# Altium project PHANTOM_VCU.PrjPcb (part 2 of 3)

## Sheet Power_MCU.SchDoc
size A4; DocumentNumber: 3; SheetNumber: 3; SheetTotal: 8
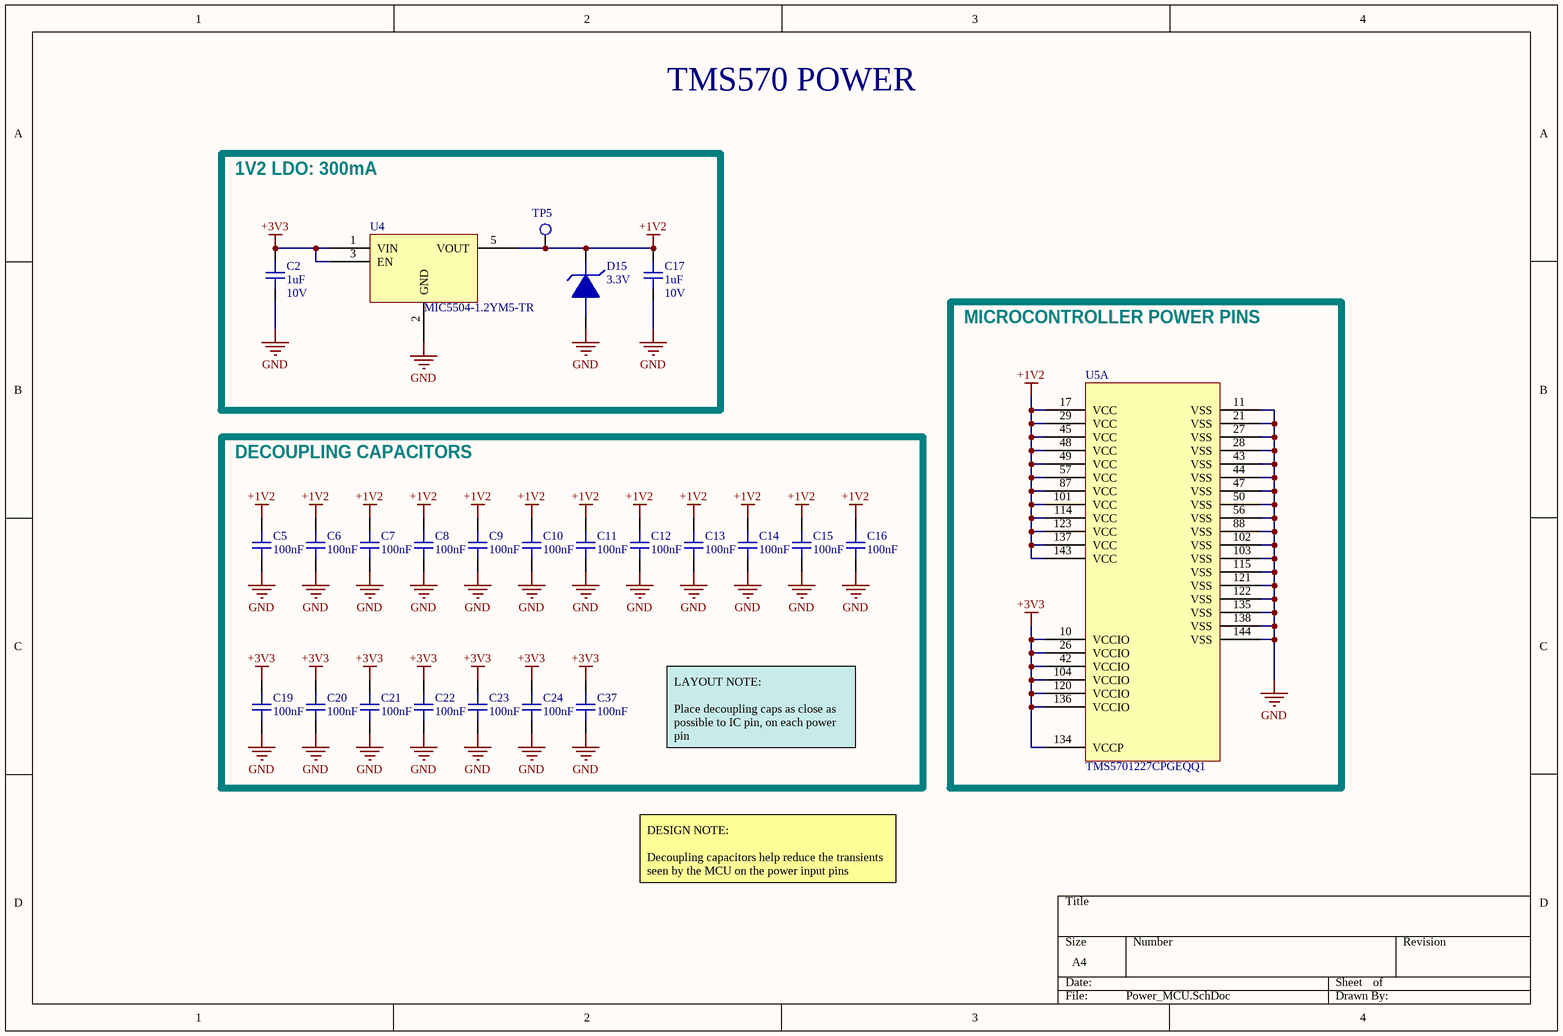
[diagram p3: Power_MCU.SchDoc]

### Parts
C2  1uF  Voltage Rating: 10V  [C0402]
C5  100nF  [C0402]
C6  100nF  [C0402]
C7  100nF  [C0402]
C8  100nF  [C0402]
C9  100nF  [C0402]
C10  100nF  [C0402]
C11  100nF  [C0402]
C12  100nF  [C0402]
C13  100nF  [C0402]
C14  100nF  [C0402]
C15  100nF  [C0402]
C16  100nF  [C0402]
C17  1uF  Voltage Rating: 10V  [C0402]
C19  100nF  [C0402]
C20  100nF  [C0402]
C21  100nF  [C0402]
C22  100nF  [C0402]
C23  100nF  [C0402]
C24  100nF  [C0402]
C37  100nF  [C0402]
D15  3.3V  [DIODE_TVS]
TP5  5015  [TP_HOOK]  (value not drawn)
U4  MIC5504-1.2YM5-TR  [SOT23-5-MIC5504]
U5  TMS5701227CPGEQQ1  [LQFP-144]  (part A of 3)

### Blocks framed on the sheet
1V2 LDO: 300mA: C2 C17 D15 TP5 U4
MICROCONTROLLER POWER PINS: U5
DECOUPLING CAPACITORS: C5-C16 C19-C24 C37

### Nets
+1V2: C5.2 C6.2 C7.2 C8.2 C9.2 C10.2 C11.2 C12.2 C13.2 C14.2 C15.2 C16.2 C17.2 D15.1 TP5.1 U4.5(VOUT) U5.17(VCC) U5.29(VCC) U5.45(VCC) U5.48(VCC) U5.49(VCC) U5.57(VCC) U5.87(VCC) U5.101(VCC) U5.114(VCC) U5.123(VCC) U5.137(VCC) U5.143(VCC)
+3V3: C2.2 C19.2 C20.2 C21.2 C22.2 C23.2 C24.2 C37.2 U4.1(VIN) U4.3(EN) U5.10(VCCIO) U5.26(VCCIO) U5.42(VCCIO) U5.104(VCCIO) U5.120(VCCIO) U5.134(VCCP) U5.136(VCCIO)
GND: C2.1 C5.1 C6.1 C7.1 C8.1 C9.1 C10.1 C11.1 C12.1 C13.1 C14.1 C15.1 C16.1 C17.1 C19.1 C20.1 C21.1 C22.1 C23.1 C24.1 C37.1 D15.2 U4.2(GND) U5.11(VSS) U5.21(VSS) U5.27(VSS) U5.28(VSS) U5.43(VSS) U5.44(VSS) U5.47(VSS) U5.50(VSS) U5.56(VSS) U5.88(VSS) U5.102(VSS) U5.103(VSS) U5.115(VSS) U5.121(VSS) U5.122(VSS) U5.135(VSS) U5.138(VSS) U5.144(VSS)

### Notes on the sheet
- TMS570 POWER
- LAYOUT NOTE:
  Place decoupling caps as close as possible to IC pin, on each power pin
- DESIGN NOTE:
  Decoupling capacitors help reduce the transients seen by the MCU on the power input pins

### Library data of the parts
C2 C17 = CL05A105MP5NNNC: CAP MLCC 1uF 10V 0402 X5R 20% SMD 0402 85C Paper T/R; Manufacturer: Samsung; Supplier 1: Digi-Key; Manufacturer Part Number: CL05A105MP5NNNC; Stock 1: 100000; Pricing 1: 1=0.1, 10=0.031, 100=0.014, 500=0.01, 1000=0.0079, 2500=0.0072, 5000=0.0066 (USD); Mount: Surface Mount; Case/Package: 0402; Case Code (Metric): 1005; Case Code (Imperial): 0402; Min Operating Temperature: -55°C; Max Operating Temperature: 85°C; Package Quantity: 1; Packaging: Tape and Reel; Capacitance: 1uF; Tolerance: 20%; Dielectric: X5R; Voltage Rating (DC): 10V; Length: 1mm; Height: 0.5mm; Width: 0.02inch; Thickness: 0.022inch; Depth: 0.5mm; Radiation Hardening: No; Lead Free: Lead Free; ComponentLink1URL: https://media.digikey.com/pdf/Data%20Sheets/Samsung%20PDFs/CL_Series_MLCC_ds.pdf; ComponentLink1Description: https://media.digikey.com/pdf/Data%20Sheets/Samsung%20PDFs/CL_Series_MLCC_ds.pdf; Supplier Part Number 1: 1276-1448-1-ND
C5-C16 C19-C24 C37 = CL05A104MP5NNNC: CAP MLCC 0.1uF 10V X5R 0402 20% SMD 0402 85C Paper T/R; Manufacturer: Samsung; Supplier 1: Digi-Key; Manufacturer Part Number: CL05A104MP5NNNC; Stock 1: 100000; Pricing 1: 1=0.1, 10=0.024, 100=0.0106, 500=0.0076, 1000=0.006, 2500=0.0054, 5000=0.005 (USD); Mount: Surface Mount; Case/Package: 0402; Case Code (Metric): 1005; Case Code (Imperial): 0402; Min Operating Temperature: -55°C; Max Operating Temperature: 85°C; Packaging: Tape and Reel; Capacitance: 100nF; Tolerance: 20%; Voltage Rating: 10V; Dielectric: X5R; Voltage Rating (DC): 10V; Length: 1mm; Height: 0.5mm; Width: 0.02inch; Thickness: 0.022inch; Depth: 0.5mm; Radiation Hardening: No; Lead Free: Lead Free; ComponentLink1URL: https://media.digikey.com/pdf/Data%20Sheets/Samsung%20PDFs/CL_Series_MLCC_ds.pdf; ComponentLink1Description: https://media.digikey.com/pdf/Data%20Sheets/Samsung%20PDFs/CL_Series_MLCC_ds.pdf; Supplier Part Number 1: 1276-1443-1-ND
D15 = 1SMA5913BT3G: DIODE ZENER 3.3V 1.5W SMA; Manufacturer: ON Semiconductor; Material: Plastic; Forward Voltage: 1.5V; Tolerance: 5%; Impedance: 10R; Max Reverse Leakage Current: 50uA; Power Dissipation: 500mW; Zener Current: 455mA; Test Current: 113.6mA; Element Configuration: Single; Breakdown Voltage: 3.47V; Supplier 1: Digi-Key; Manufacturer Part Number: 1SMA5913BT3G; Stock 1: 12228; Pricing 1: 1=0.38, 10=0.305, 100=0.2076, 500=0.1557, 1000=0.1168 (USD); Case/Package: SMA; Number of Pins: 2; Min Operating Temperature: -65°C; Max Operating Temperature: 150°C; Max Power Dissipation: 1.5W; Package Quantity: 1; Packaging: Tape and Reel; Zener Voltage: 3.3V; Voltage Tolerance: 5%; Working Voltage: 3.3V; Peak Reverse Current: 50uA; Voltage Rating (DC): 3.3V; Power Rating: 1.5W; Length: 4.57mm; Height: 2.05mm; Width: 2.92mm; Radiation Hardening: No; REACH SVHC: No SVHC; Lead Free: Lead Free; Halogen Free: Halogen Free; ComponentLink1URL: https://datasheet.ciiva.com/8026/1sma5913bt3-d-8026917.pdf; ComponentLink1Description: https://datasheet.ciiva.com/8026/1sma5913bt3-d-8026917.pdf; ComponentLink2URL: https://datasheet.ciiva.com/8345/1sma5913bt3-d-8345864.pdf; ComponentLink2Description: https://datasheet.ciiva.com/8345/1sma5913bt3-d-8345864.pdf; ComponentLink3URL: https://datasheet.ciiva.com/8346/1sma5913bt3-d-8346488.pdf; ComponentLink3Description: https://datasheet.ciiva.com/8346/1sma5913bt3-d-8346488.pdf; ComponentLink4URL: https://datasheet.ciiva.com/895/1sma5913bt3-d-895306.pdf; ComponentLink4Description: https://datasheet.ciiva.com/895/1sma5913bt3-d-895306.pdf; ComponentLink5URL: https://datasheet.ciiva.com/15142/getdatasheetpartid-90498-15142554.pdf; ComponentLink5Description: https://datasheet.ciiva.com/15142/getdatasheetpartid-90498-15142554.pdf; ComponentLink6URL: https://datasheet.ciiva.com/895/1sma5913bt3-d-895307.pdf; ComponentLink6Description: https://datasheet.ciiva.com/895/1sma5913bt3-d-895307.pdf; ComponentLink7URL: https://datasheet.ciiva.com/4733/1sma5913bt3-d-4733195.pdf; ComponentLink7Description: https://datasheet.ciiva.com/4733/1sma5913bt3-d-4733195.pdf; ComponentLink8URL: https://datasheet.ciiva.com/895/1sma5913bt3-d-895308.pdf; ComponentLink8Description: https://datasheet.ciiva.com/895/1sma5913bt3-d-895308.pdf; ComponentLink9URL: https://datasheet.ciiva.com/16472/1sma5913bt3-d-16472764.pdf; ComponentLink9Description: https://datasheet.ciiva.com/16472/1sma5913bt3-d-16472764.pdf; ComponentLink10URL: https://datasheet.ciiva.com/49027/70339279-49027772.pdf; ComponentLink10Description: https://datasheet.ciiva.com/49027/70339279-49027772.pdf; ComponentLink11URL: https://datasheet.ciiva.com/8026/1sma5913bt3-d-8026989.pdf; ComponentLink11Description: https://datasheet.ciiva.com/8026/1sma5913bt3-d-8026989.pdf; ComponentLink12URL: https://datasheet.ciiva.com/8026/1sma5913bt3-d-8026990.pdf; ComponentLink12Description: https://datasheet.ciiva.com/8026/1sma5913bt3-d-8026990.pdf; ComponentLink13URL: https://datasheet.ciiva.com/26092/1sma5913bt3-d-26092398.pdf; ComponentLink13Description: https://datasheet.ciiva.com/26092/1sma5913bt3-d-26092398.pdf; Supplier Part Number 1: 1SMA5913BT3GOSCT-ND
TP5 = 5015: TEST POINT, PCB, SMT; Manufacturer: Keystone Electronics; Number of Ports: 1; Supplier 1: Digi-Key; Manufacturer Part Number: 5015; Stock 1: 1937775; Pricing 1: 1=0.44, 10=0.421, 25=0.3604, 50=0.3064, 100=0.2944, 250=0.2644, 500=0.2524 (USD); Mount: Surface Mount; Colour: White; Contact Material: Bronze; Contact Plating: Tin,Silver,Lead; Material: Bronze,Silver; Package Quantity: 1; Packaging: Tape and Reel; Termination: Solder; Orientation: Straight; Length: 2.66mm; Height: 0.06inch; Thickness: 0.01inch; Depth: 1.01mm; REACH SVHC: No SVHC; Lead Free: Lead Free; ComponentLink1URL: https://datasheet.ciiva.com/2917/5015-2917616.pdf; ComponentLink1Description: https://datasheet.ciiva.com/2917/5015-2917616.pdf; ComponentLink2URL: https://datasheet.ciiva.com/2917/5015-2917617.pdf; ComponentLink2Description: https://datasheet.ciiva.com/2917/5015-2917617.pdf; ComponentLink3URL: https://datasheet.ciiva.com/1123/5015-1123862.pdf; ComponentLink3Description: https://datasheet.ciiva.com/1123/5015-1123862.pdf; ComponentLink4URL: https://datasheet.ciiva.com/16883/70182998-16883734.pdf; ComponentLink4Description: https://datasheet.ciiva.com/16883/70182998-16883734.pdf; Supplier Part Number 1: 36-5015CT-ND
U4 = MIC5504-1.2YM5-TR: IC LDO 1.2V 300mA Enable Pull-Down & Auto Discharge, 5 SOT-23 T/R; Manufacturer: Microchip; Dropout Voltage: 160mV; Number of Regulators: 1; Min Current Limit: 400mA; Supplier 1: Digi-Key; Manufacturer Part Number: MIC5504-1.2YM5-TR; Stock 1: 479; Pricing 1: 1=0.11, 25=0.0928, 100=0.0824 (USD); Mount: Surface Mount; Case/Package: SOT-23-5; Min Operating Temperature: -40°C; Max Operating Temperature: 125°C; Packaging: Cut Tape; Output Voltage: 1.2V; Output Current: 300mA; Supplier Part Number 1: 576-4878-1-ND
U5 = TMS5701227CPGEQQ1: IC MCU 16-Bit/32-Bit Hercules TMS570 ARM Cortex R4F RISC 1280KB Flash 1.2V/3.3V 144-Pin LQFP; Manufacturer: Texas Instruments; Frequency: 160MHz; Interface: CAN,EBI/EMI,Ethernet,I2C,LIN,SCI,SPI,UART,USART; Number of I/Os: 58; Oscillator Type: External; RAM Size: 192KB; Number of Timers/Counters: 2; Watchdog Timer: Yes; Memory Size: 1.25MB; Density: 1310720B; Peripherals: DMA,POR,PWM,WDT; Supplier 1: Digi-Key; Manufacturer Part Number: TMS5701227CPGEQQ1; Stock 1: 2872; Pricing 1: 1=24.99, 10=23.046, 60=22.0098, 120=19.6794, 540=17.8669 (USD); Case/Package: LQFP; Number of Pins: 144; Min Operating Temperature: -40°C; Max Operating Temperature: 125°C; Packaging: Tray; Number of Programmable I/O: 58; Max Frequency: 160MHz; Memory Type: FLASH; Number of GPIO: 58; Core Architecture: ARM; Lead Free: Lead Free; Supplier Part Number 1: 296-42451-ND

## Sheet VCU_Schematic.SchDoc
size A4; DocumentNumber: 4; SheetNumber: 4; SheetTotal: 8
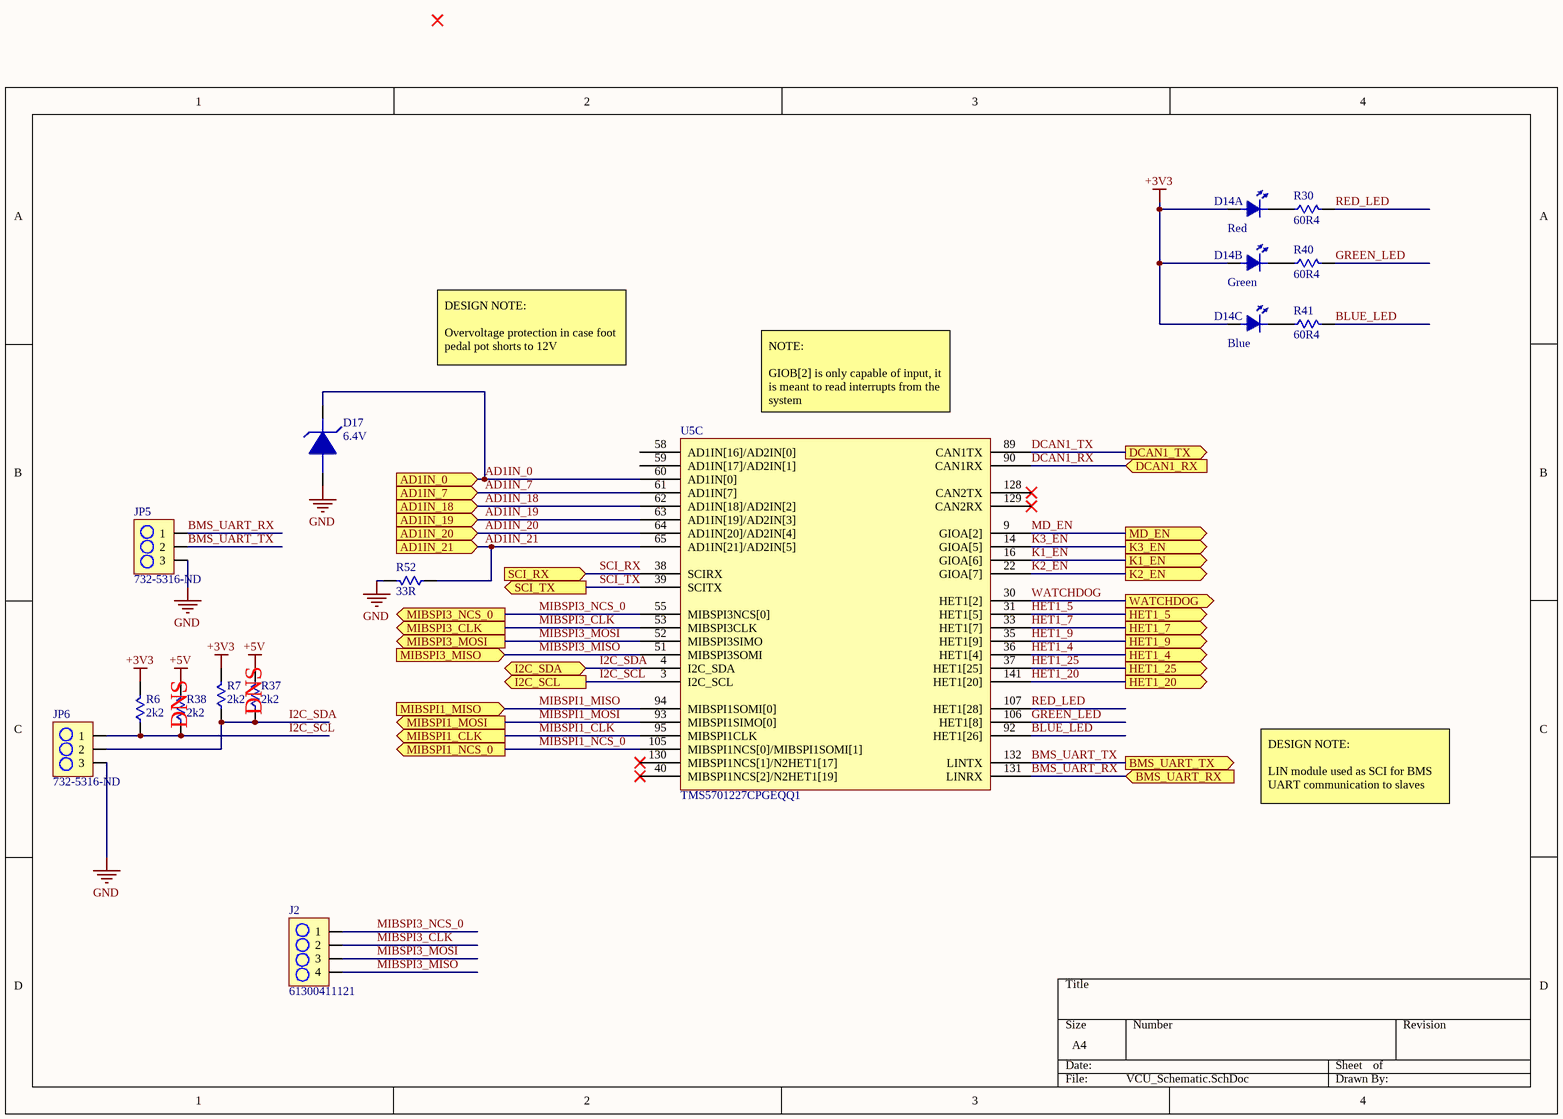
[diagram p4: VCU_Schematic.SchDoc]

### Parts
(Parts that share a designator on the sheet are numbered #1, #2 ... from top to bottom, then left to right.)
D14  EAST1616RGBB4  [LED_TRICOLOR]  (value not drawn)  (parts A,B,C of 3)
D17  6.4V  [DIODE_TVS]
J2  61300411121  [4PIN_HEADER]
JP5  732-5316-ND  [3PIN_HEADER]
JP6  732-5316-ND  [3PIN_HEADER]
R6  2k2  [R0402]
R7  2k2  [R0402]
R30  60R4  [R0402]
R37  2k2  [R0402]
R38#1  2k2  [R0402]
R40  60R4  [R0402]
R41  60R4  [R0402]
R52  33R  [R0805-3D]
U5  TMS5701227CPGEQQ1  [LQFP-144]  (part C of 3)

### Ports
AD1IN_0, AD1IN_7, AD1IN_18, AD1IN_19, AD1IN_20, AD1IN_21, BMS_UART_RX, BMS_UART_TX, DCAN1_RX, DCAN1_TX, HET1_4, HET1_5, HET1_7, HET1_9, HET1_20, HET1_25, I2C_SCL, I2C_SDA, K1_EN, K2_EN, K3_EN, MD_EN, MIBSPI1_CLK, MIBSPI1_MISO, MIBSPI1_MOSI, MIBSPI1_NCS_0, MIBSPI3_CLK, MIBSPI3_MISO, MIBSPI3_MOSI, MIBSPI3_NCS_0, SCI_RX, SCI_TX, WATCHDOG

### Nets
+3V3: D14.4 R6.2 R7.2
+5V: R37.2 R38#1.2
GND: D17.2 JP5.3 JP6.3 R52.2
AD1IN_0: D17.1 U5.60(AD1IN[0]) ; port AD1IN_0
AD1IN_7: U5.61(AD1IN[7]) ; port AD1IN_7
AD1IN_18: U5.62(AD1IN[18]/AD2IN[2]) ; port AD1IN_18
AD1IN_19: U5.63(AD1IN[19]/AD2IN[3]) ; port AD1IN_19
AD1IN_20: U5.64(AD1IN[20]/AD2IN[4]) ; port AD1IN_20
AD1IN_21: R52.1 U5.65(AD1IN[21]/AD2IN[5]) ; port AD1IN_21
BLUE_LED: R41.2 U5.92(HET1[26])
BMS_UART_RX: JP5.1 U5.131(LINRX) ; port BMS_UART_RX
BMS_UART_TX: JP5.2 U5.132(LINTX) ; port BMS_UART_TX
DCAN1_RX: U5.90(CAN1RX) ; port DCAN1_RX
DCAN1_TX: U5.89(CAN1TX) ; port DCAN1_TX
GREEN_LED: R40.2 U5.106(HET1[8])
HET1_4: U5.36(HET1[4]) ; port HET1_4
HET1_5: U5.31(HET1[5]) ; port HET1_5
HET1_7: U5.33(HET1[7]) ; port HET1_7
HET1_9: U5.35(HET1[9]) ; port HET1_9
HET1_20: U5.141(HET1[20]) ; port HET1_20
HET1_25: U5.37(HET1[25]) ; port HET1_25
I2C_SCL: JP6.1 R6.1 R38#1.1 U5.3(I2C_SCL) ; port I2C_SCL
I2C_SDA: JP6.2 R7.1 R37.1 U5.4(I2C_SDA) ; port I2C_SDA
K1_EN: U5.16(GIOA[6]) ; port K1_EN
K2_EN: U5.22(GIOA[7]) ; port K2_EN
K3_EN: U5.14(GIOA[5]) ; port K3_EN
MD_EN: U5.9(GIOA[2]) ; port MD_EN
MIBSPI1_CLK: U5.95(MIBSPI1CLK) ; port MIBSPI1_CLK
MIBSPI1_MISO: U5.94(MIBSPI1SOMI[0]) ; port MIBSPI1_MISO
MIBSPI1_MOSI: U5.93(MIBSPI1SIMO[0]) ; port MIBSPI1_MOSI
MIBSPI1_NCS_0: U5.105(MIBSPI1NCS[0]/MIBSPI1SOMI[1]) ; port MIBSPI1_NCS_0
MIBSPI3_CLK: J2.2 U5.53(MIBSPI3CLK) ; port MIBSPI3_CLK
MIBSPI3_MISO: J2.4 U5.51(MIBSPI3SOMI) ; port MIBSPI3_MISO
MIBSPI3_MOSI: J2.3 U5.52(MIBSPI3SIMO) ; port MIBSPI3_MOSI
MIBSPI3_NCS_0: J2.1 U5.55(MIBSPI3NCS[0]) ; port MIBSPI3_NCS_0
RED_LED: R30.2 U5.107(HET1[28])
SCI_RX: U5.38(SCIRX) ; port SCI_RX
SCI_TX: U5.39(SCITX) ; port SCI_TX
WATCHDOG: U5.30(HET1[2]) ; port WATCHDOG
NetD14_1: D14.1 R30.1
NetD14_2: D14.2 R40.1
NetD14_3: D14.3 R41.1

Not connected (* = marked no-connect by the designer): U5 40(MIBSPI1NCS[2]/N2HET1[19])* 58(AD1IN[16]/AD2IN[0]) 59(AD1IN[17]/AD2IN[1]) 128(CAN2TX)* 129(CAN2RX)* 130(MIBSPI1NCS[1]/N2HET1[17])*

### Notes on the sheet
- DESIGN NOTE:
  Overvoltage protection in case foot pedal pot shorts to 12V
- (near U5) NOTE:
  GIOB[2] is only capable of input, it is meant to read interrupts from the system
- (near R38#1) DNS
- (near R37) DNS
- DESIGN NOTE:
  LIN module used as SCI for BMS UART communication to slaves
- (in symbol EAST1616RGBB4, part A) Red
- (in symbol EAST1616RGBB4, part B) Green
- (in symbol EAST1616RGBB4, part C) Blue

### Library data of the parts
D14 = EAST1616RGBB4: LED TRICOLOR RED GREEN BLUE; Manufacturer: Everlight; Supplier 1: Digi-Key; Manufacturer Part Number: EAST1616RGBB4; Stock 1: 0; Supplier Part Number 1: 1080-1552-2-ND
D17 = SMAJ5.0A: DIODE TVS_6V4 5VWM 9.2VC SMA; Manufacturer: Littelfuse; Clamping Voltage: 9.2V; Polarity: Unidirectional; Power Dissipation: 400W; Voltage Rating (DC): 5V; Number of Elements: 1; Max Surge Current: 43.5A; Power Line Protection: No; Test Current: 10mA; Max Breakdown Voltage: 7V; Max Reverse Leakage Current: 800uA; Max Power Dissipation: 3.3W; Element Configuration: Single; Supplier 1: Digi-Key; Manufacturer Part Number: SMAJ5.0A; Stock 1: 78251; Pricing 1: 1=0.51, 10=0.359, 25=0.2948, 100=0.2359, 250=0.1716, 500=0.1394, 1000=0.1072, 2500=0.0965 (USD); Mount: Surface Mount; Number of Pins: 2; Min Operating Temperature: -65°C; Max Operating Temperature: 150°C; Direction: Unidirectional; Package Quantity: 5000; Operating Supply Voltage: 5V; Packaging: Tape and Reel; Reverse Breakdown Voltage: 6.4V; Number of Unidirectional Channels: 1; Reverse Standoff Voltage: 5V; Min Breakdown Voltage: 6.4V; Peak Pulse Power: 400W; Breakdown Voltage: 6.4V; Number of Channels: 1; Termination: SMD/SMT; Peak Pulse Current: 43.5A; Leakage Current: 800uA; Length: 4.5mm; Height: 2.087mm; Width: 2.79mm; Radiation Hardening: No; REACH SVHC: No SVHC; Lead Free: Lead Free; ComponentLink1URL: https://datasheet.ciiva.com/330/littelfuse-tvs-diode-smaj-datasheet-pdf-330724.pdf; ComponentLink1Description: https://datasheet.ciiva.com/330/littelfuse-tvs-diode-smaj-datasheet-pdf-330724.pdf; ComponentLink2URL: https://datasheet.ciiva.com/330/littelfuse-tvs-diode-smaj-datasheet-pdf-330725.pdf; ComponentLink2Description: https://datasheet.ciiva.com/330/littelfuse-tvs-diode-smaj-datasheet-pdf-330725.pdf; ComponentLink3URL: https://datasheet.ciiva.com/330/littelfuse-tvs-diode-smaj-datasheet-pdf-330726.pdf; ComponentLink3Description: https://datasheet.ciiva.com/330/littelfuse-tvs-diode-smaj-datasheet-pdf-330726.pdf; ComponentLink4URL: https://datasheet.ciiva.com/16380/littelfuse-tvs-diode-smaj-16380982.pdf; ComponentLink4Description: https://datasheet.ciiva.com/16380/littelfuse-tvs-diode-smaj-16380982.pdf; ComponentLink5URL: https://datasheet.ciiva.com/25624/0900766b810f4edb-25624839.pdf; ComponentLink5Description: https://datasheet.ciiva.com/25624/0900766b810f4edb-25624839.pdf; ComponentLink6URL: https://datasheet.ciiva.com/28473/607617-28473433.pdf; ComponentLink6Description: https://datasheet.ciiva.com/28473/607617-28473433.pdf; ComponentLink7URL: https://datasheet.ciiva.com/4507/littelfuse-tvs-diode-smaj-23503-4507964.pdf; ComponentLink7Description: https://datasheet.ciiva.com/4507/littelfuse-tvs-diode-smaj-23503-4507964.pdf; ComponentLink8URL: https://datasheet.ciiva.com/8062/littelfuse-tvs-diode-smaj-8062271.pdf; ComponentLink8Description: https://datasheet.ciiva.com/8062/littelfuse-tvs-diode-smaj-8062271.pdf; Supplier Part Number 1: SMAJ5.0ALFCT-ND
J2 = 61300411121: CONN_HeaderPins4pos WURTH ELEKTRONIK         61300411121            Board-To-Board Connector, Vertical, WR-PHD Series, Through Hole, Header, 4 Contacts, 2.54 mm; Manufacturer: Wurth Electronics; Number of Positions: 4; Gender: Male; Connector Type: Male Pin; Pitch: 0.1inch; Supplier 1: Digi-Key; Manufacturer Part Number: 61300411121; Stock 1: 35015; Pricing 1: 1=0.18, 10=0.153, 25=0.1272, 50=0.106, 100=0.096, 1000=0.088 (USD); Mount: Through Hole; Contact Plating: Gold; Contact Material: Copper; Color: Black; Number of Rows: 1; Packaging: Bulk; Termination: Solder; Number of Contacts: 4; Contact Mating Length: 0.236inch; REACH SVHC: Unknown; Lead Free: Lead Free; Supplier Part Number 1: 732-5317-ND
JP5 JP6 = 61300311121: CONN_HeaderPins3pos WURTH ELEKTRONIK Board-To-Board Connector, Vertical, WR-PHD Series, Through Hole, Header, 3 Contacts, 2.54 mm; Manufacturer: Wurth Electronics; Number of Positions: 3; Gender: Male; Connector Type: Male Pin; Pitch: 0.1inch; Supplier 1: Digi-Key; Manufacturer Part Number: 61300311121; Stock 1: 57026; Pricing 1: 1=0.13, 10=0.106, 25=0.088, 50=0.074, 100=0.067, 1000=0.061 (USD); Mount: Through Hole; Case/Package: 100; Contact Plating: Gold; Contact Material: Copper; Colour: Black; Number of Rows: 1; Packaging: Bulk; Termination: Solder; Number of Contacts: 3; Contact Mating Length: 0.236inch; REACH SVHC: Unknown; Lead Free: Lead Free; ComponentLink1URL: http://www.farnell.com/cad/1737268.pdf; ComponentLink1Description: http://www.farnell.com/cad/1737268.pdf; Supplier Part Number 1: 732-5316-ND
R6 R7 R37 R38#1 = RC0402JR-072K2L: RES SMD 2.2K OHM 5% 1/16W 0402; Manufacturer: Yageo; Resistance: 2.2kR; Power Rating: 63mW; Voltage Rating: 50V; Temperature Coefficient: 100ppm/°C; Supplier 1: Digi-Key; Manufacturer Part Number: RC0402JR-072K2L; Stock 1: 7890813; Pricing 1: 1=0.1, 10=0.018, 100=0.0073, 1000=0.0033, 2500=0.0029, 5000=0.0024 (USD); Case/Package: 0402; Weight: 2.3E-05oz; Case Code (Metric): 1005; Case Code (Imperial): 0402; Min Operating Temperature: -55°C; Max Operating Temperature: 155°C; Tolerance: 5%; Packaging: Tape and Reel; Composition: Thick Film; Termination: SMD/SMT; Military Standard: Not; Package Quantity: 1; Number of Terminations: 2; Max Power Dissipation: 63mW; Working Voltage: 50V; Features: Moisture Resistant; Length: 1mm; Height: 0.016inch; Depth: 0.5mm; Width: 0.02inch; REACH SVHC: Unknown; Lead Free: Lead Free; Supplier Part Number 1: 311-2.2KJRCT-ND
R30 R40 R41 = RMCF0402FT60R4: RES SMD 60.4 OHM 1% 0402 1/16W 100ppm/C Molded SMD SMD Paper T/R; Manufacturer: Stackpole Electronics; Resistance: 60.4R; Max Power Dissipation: 63mW; Temperature Coefficient: 100ppm/°C; Supplier 1: Digi-Key; Manufacturer Part Number: RMCF0402FT60R4; Stock 1: 29830; Pricing 1: 1=0.1, 10=0.016, 100=0.0064, 1000=0.0029, 2500=0.0025, 5000=0.0021 (USD); Mount: Surface Mount; Case/Package: 0402; Case Code (Metric): 1005; Case Code (Imperial): 0402; Contact Plating: Matte,Tin; Min Operating Temperature: -55°C; Max Operating Temperature: 155°C; Packaging: Tape and Reel; Tolerance: 1%; Composition: Thick Film; Number of Terminations: 2; Features: Automotive AEC-Q200; Length: 0.039inch; Height: 0.016inch; Width: 0.02inch; Radiation Hardening: No; Lead Free: Lead Free; Supplier Part Number 1: RMCF0402FT60R4CT-ND
R52 = ESR10EZPJ330: RES SMD 33 OHM 5% 0.4W 0805; Manufacturer: Rohm; Temperature Coefficient: 200ppm/°C; Max Power Dissipation: 400mW; Supplier 1: Digi-Key; Manufacturer Part Number: ESR10EZPJ330; Stock 1: 8927; Pricing 1: 1=0.1, 10=0.083, 100=0.0318, 1000=0.014, 2500=0.0121 (USD); Case/Package: 0805; Case Code (Metric): 2012; Case Code (Imperial): 0805; Min Operating Temperature: -55°C; Max Operating Temperature: 155°C; Package Quantity: 1; Resistance: 33R; Tolerance: 5%; Packaging: Tape and Reel; Composition: Thick Film; Number of Terminations: 2; Features: Automotive AEC-Q200; Power Rating: 400mW; Length: 0.079inch; Height: 0.026inch; Width: 0.049inch; Lead Free: Lead Free; ComponentLink1URL: http://www.rohm.com/web/global/datasheet/ESR01MZPF/esr-e?src-supplier=Digi-Key; ComponentLink1Description: http://www.rohm.com/web/global/datasheet/ESR01MZPF/esr-e?src-supplier=Digi-Key; ComponentLink2URL: https://www.rohm.com/datasheet/ESR01MZPF/esr-e?src-supplier=Digi-Key; ComponentLink2Description: https://www.rohm.com/datasheet/ESR01MZPF/esr-e?src-supplier=Digi-Key; ComponentLink3URL: http://www1.futureelectronics.com/doc/ROHM%20SEMICONDUCTOR/ESR10EZPD.pdf?src-supplier=Future+Electronics; ComponentLink3Description: http://www1.futureelectronics.com/doc/ROHM%20SEMICONDUCTOR/ESR10EZPD.pdf?src-supplier=Future+Electronics; Supplier Part Number 1: RHM33KCT-ND
U5 = TMS5701227CPGEQQ1: as U5 on sheet Power_MCU; Supplier 1: Digi-Key; Manufacturer Part Number: TMS5701227CPGEQQ1; Stock 1: 2872; Pricing 1: 1=24.99, 10=23.046, 60=22.0098, 120=19.6794, 540=17.8669 (USD); Case/Package: LQFP; Number of Pins: 144; Min Operating Temperature: -40°C; Max Operating Temperature: 125°C; Packaging: Tray; Number of Programmable I/O: 58; Max Frequency: 160MHz; Memory Type: FLASH; Number of GPIO: 58; Core Architecture: ARM; Lead Free: Lead Free; Supplier Part Number 1: 296-42451-ND

## Sheet MCU_Signals.SchDoc
size A4; DocumentNumber: 5; SheetNumber: 5; SheetTotal: 8
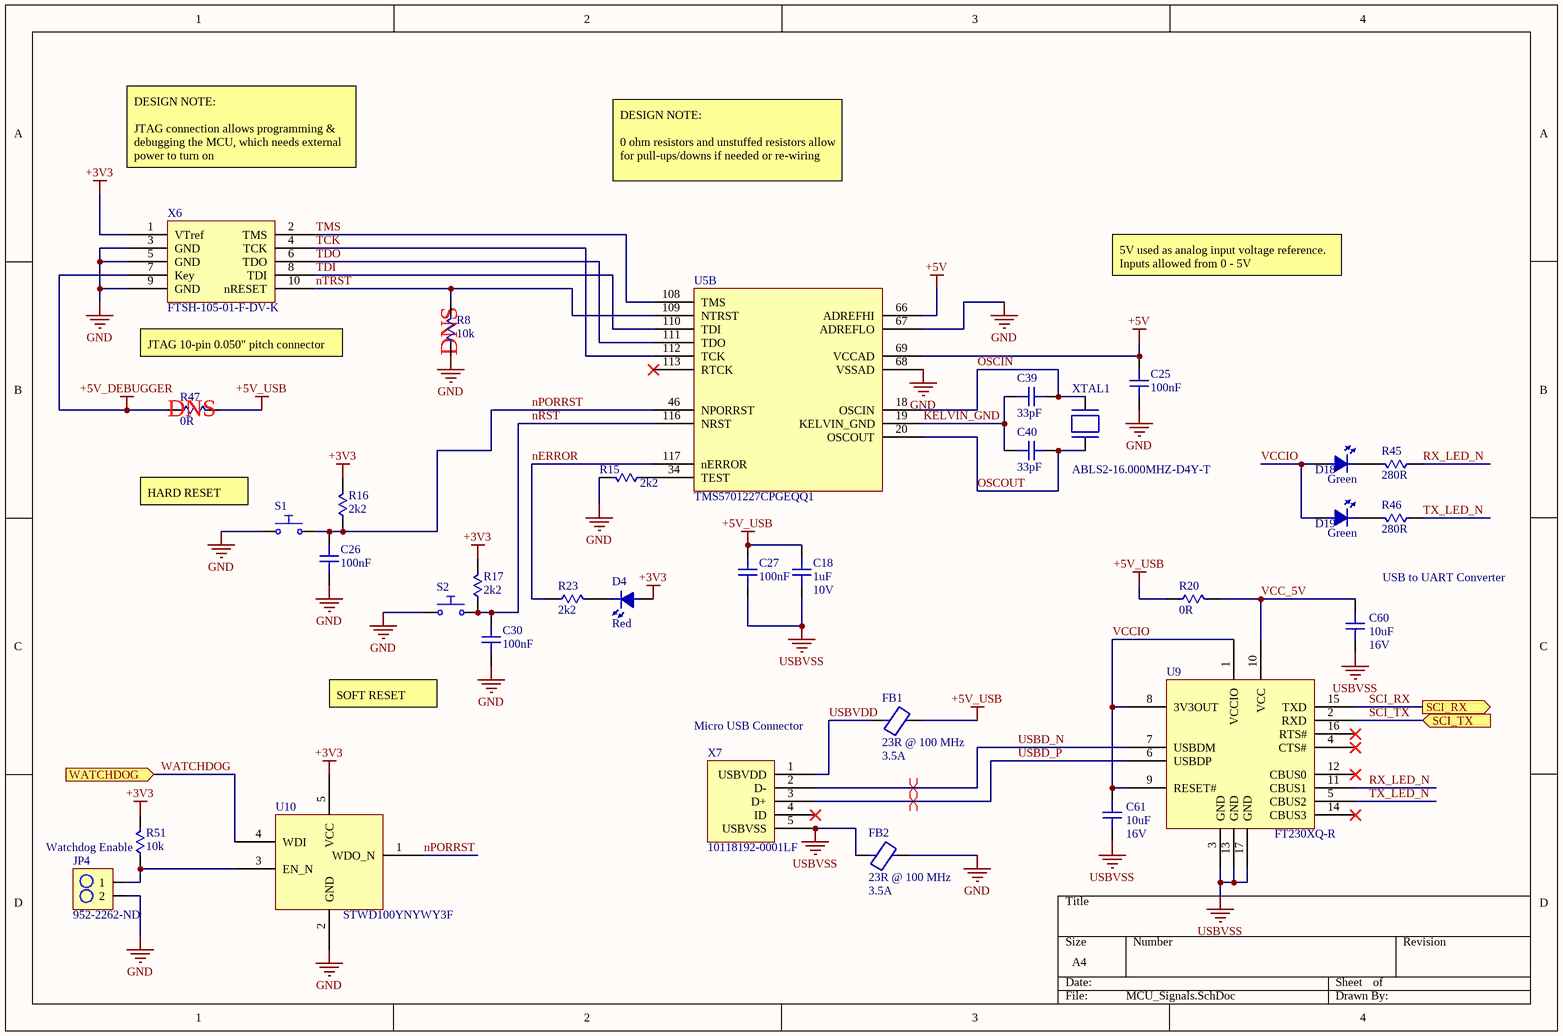
[diagram p5: MCU_Signals.SchDoc]

### Parts
C18  1uF  Voltage Rating: 10V  [C0402]
C25  100nF  [C0402]
C26  100nF  [C0402]
C27  100nF  [C0402]
C30  100nF  [C0402]
C39  33pF  [C0402]
C40  33pF  [C0402]
C60  10uF  Voltage Rating: 16V  [C0805]
C61  10uF  Voltage Rating: 16V  [C0805]
D4  Red  [LED_0603]
D18  Green  [LED_0603]
D19  Green  [LED_0603]
FB1  23R @ 100 MHz  Max Current Rating: 3.5A  [FB_1806]
FB2  23R @ 100 MHz  Max Current Rating: 3.5A  [FB_1806]
JP4  952-2262-ND  [2PIN_HEADER]
R8  10k  [R0402]
R15  2k2  [R0402]
R16  2k2  [R0402]
R17  2k2  [R0402]
R20  0R  [R0402]
R23  2k2  [R0402]
R45  280R  [R0402]
R46  280R  [R0402]
R47  0R  [R0402]
R51  10k  [R0402]
S1  PTS645SM43SMTR92LFS  [PUSH_BUTTON]  (value not drawn)
S2  PTS645SM43SMTR92LFS  [PUSH_BUTTON]  (value not drawn)
U5  TMS5701227CPGEQQ1  [LQFP-144]  (part B of 3)
U9  FT230XQ-R  [QFN16-EP]
U10  STWD100YNYWY3F  [SOT23-5-WATCHDOG]
X6  FTSH-105-01-F-DV-K  [JTAG_50mil_10pin]
X7  10118192-0001LF  [USB_MICRO]
XTAL1  ABLS2-16.000MHZ-D4Y-T  [XTAL]

### Ports
SCI_RX, SCI_TX, WATCHDOG

### Nets
+3V3: D4.1 R16.2 R17.2 R51.2 U10.5(VCC) X6.1(VTref)
+5V: C25.2 U5.66(ADREFHI) U5.69(VCCAD)
+5V_DEBUGGER: R47.1 X6.7(Key)
+5V_USB: C18.2 C27.1 FB1.2 R20.1 R47.2
GND: C25.1 C26.1 C30.1 FB2.2 JP4.2 R8.1 R15.2 S1.1 S2.1 U5.67(ADREFLO) U5.68(VSSAD) U10.2(GND) X6.3(GND) X6.5(GND) X6.9(GND)
USBVSS: C18.1 C27.2 C60.1 C61.1 FB2.1 U9.3(GND) U9.13(GND) U9.17(GND) X7.5(USBVSS)
KELVIN_GND: C39.2 C40.2 U5.19(KELVIN_GND)
nERROR: R23.1 U5.117(nERROR)
nPORRST: C26.2 R16.1 S1.2 U5.46(NPORRST) U10.1(WDO_N)
nRST: C30.2 R17.1 S2.2 U5.116(NRST)
nTRST: R8.2 U5.109(NTRST) X6.10(nRESET)
OSCIN: C39.1 U5.18(OSCIN) XTAL1.1
OSCOUT: C40.1 U5.20(OSCOUT) XTAL1.2
RX_LED_N: R45.1 U9.11(CBUS1)
SCI_RX: U9.15(TXD) ; port SCI_RX
SCI_TX: U9.2(RXD) ; port SCI_TX
TCK: U5.112(TCK) X6.4(TCK)
TDI: U5.110(TDI) X6.8(TDI)
TDO: U5.111(TDO) X6.6(TDO)
TMS: U5.108(TMS) X6.2(TMS)
TX_LED_N: R46.1 U9.5(CBUS2)
USBD_N: U9.7(USBDM) X7.2(D-)
USBD_P: U9.6(USBDP) X7.3(D+)
USBVDD: FB1.1 X7.1(USBVDD)
VCC_5V: C60.2 R20.2 U9.10(VCC)
VCCIO: C61.2 D18.1 D19.1 U9.1(VCCIO) U9.8(3V3OUT) U9.9(RESET#)
WATCHDOG: U10.4(WDI) ; port WATCHDOG
NetD4_2: D4.2 R23.2
NetD18_2: D18.2 R45.2
NetD19_2: D19.2 R46.2
NetJP4_1: JP4.1 R51.1 U10.3(EN_N)
NetR15_1: R15.1 U5.34(TEST)

Not connected (* = marked no-connect by the designer): U5 113(RTCK)*; U9 4(CTS#)* 12(CBUS0)* 14(CBUS3)* 16(RTS#)*; X7 4(ID)*

### Layout directives
differential pair: USBD_N, USBD_P

### Notes on the sheet
- DESIGN NOTE:
  JTAG connection allows programming & debugging the MCU, which needs external power to turn on
- DESIGN NOTE:
  0 ohm resistors and unstuffed resistors allow for pull-ups/downs if needed or re-wiring
- 5V used as analog input voltage reference. Inputs allowed from 0 - 5V
- JTAG 10-pin 0.050" pitch connector
- (near R8) DNS
- (near R47) DNS
- (near S1) HARD RESET
- USB to UART Converter
- SOFT RESET
- (near X7) Micro USB Connector
- (near R51) Watchdog Enable

### Library data of the parts
C18 = CL05A105MP5NNNC: as C2 on sheet Power_MCU; Supplier 1: Digi-Key; Manufacturer Part Number: CL05A105MP5NNNC; Stock 1: 100000; Pricing 1: 1=0.1, 10=0.031, 100=0.014, 500=0.01, 1000=0.0079, 2500=0.0072, 5000=0.0066 (USD); Mount: Surface Mount; Case/Package: 0402; Case Code (Metric): 1005; Case Code (Imperial): 0402; Min Operating Temperature: -55°C; Max Operating Temperature: 85°C; Package Quantity: 1; Packaging: Tape and Reel; Capacitance: 1uF; Tolerance: 20%; Dielectric: X5R; Voltage Rating (DC): 10V; Length: 1mm; Height: 0.5mm; Width: 0.02inch; Thickness: 0.022inch; Depth: 0.5mm; Radiation Hardening: No; Lead Free: Lead Free; ComponentLink1URL: https://media.digikey.com/pdf/Data%20Sheets/Samsung%20PDFs/CL_Series_MLCC_ds.pdf; ComponentLink1Description: https://media.digikey.com/pdf/Data%20Sheets/Samsung%20PDFs/CL_Series_MLCC_ds.pdf; Supplier Part Number 1: 1276-1448-1-ND
C25-C27 C30 = CL05A104MP5NNNC: as C5 on sheet Power_MCU; Supplier 1: Digi-Key; Manufacturer Part Number: CL05A104MP5NNNC; Stock 1: 100000; Pricing 1: 1=0.1, 10=0.024, 100=0.0106, 500=0.0076, 1000=0.006, 2500=0.0054, 5000=0.005 (USD); Mount: Surface Mount; Case/Package: 0402; Case Code (Metric): 1005; Case Code (Imperial): 0402; Min Operating Temperature: -55°C; Max Operating Temperature: 85°C; Packaging: Tape and Reel; Capacitance: 100nF; Tolerance: 20%; Voltage Rating: 10V; Dielectric: X5R; Voltage Rating (DC): 10V; Length: 1mm; Height: 0.5mm; Width: 0.02inch; Thickness: 0.022inch; Depth: 0.5mm; Radiation Hardening: No; Lead Free: Lead Free; ComponentLink1URL: https://media.digikey.com/pdf/Data%20Sheets/Samsung%20PDFs/CL_Series_MLCC_ds.pdf; ComponentLink1Description: https://media.digikey.com/pdf/Data%20Sheets/Samsung%20PDFs/CL_Series_MLCC_ds.pdf; Supplier Part Number 1: 1276-1443-1-ND
C39 C40 = 885012005010: CAP MLCC 33pF 10V C0G, NP0 0402 (1005 Metric) 0.039" L x 0.020" W (1.00mm x 0.50mm); Manufacturer: Wurth Electronics; Tolerance: 5%; Supplier 1: Digi-Key; Manufacturer Part Number: 885012005010; Stock 1: 4748; Pricing 1: 1=0.1, 10=0.015, 100=0.0132, 500=0.0116 (USD); Mount: Surface Mount; Case/Package: 0402; Case Code (Metric): 1005; Case Code (Imperial): 0402; Min Operating Temperature: -55°C; Max Operating Temperature: 125°C; Packaging: Tape and Reel; Capacitance: 33pF; Length: 0.039inch; Width: 0.02inch; Thickness: 0.022inch; Supplier Part Number 1: 732-7428-1-ND
C60 C61 = CL21A106KOQNNNE: CAP CER 10uF 16V X5R 10% SMD 0805 85C T/R; Manufacturer: Samsung; Dielectric: X7R; Supplier 1: Digi-Key; Manufacturer Part Number: CL21A106KOQNNNE; Stock 1: 20000; Pricing 1: 1=0.21, 10=0.148, 100=0.0698, 500=0.0489, 1000=0.0405 (USD); Mount: Surface Mount; Case/Package: 0805; Case Code (Metric): 2012; Case Code (Imperial): 0805; Min Operating Temperature: -55°C; Max Operating Temperature: 85°C; Package Quantity: 1; Packaging: Tape and Reel; Capacitance: 10uF; Tolerance: 10%; Voltage Rating (DC): 16V; Voltage: 16V; Length: 2mm; Height: 1.25mm; Width: 0.049inch; Thickness: 0.055inch; Depth: 1.25mm; Radiation Hardening: No; Lead Free: Lead Free; ComponentLink1URL: https://datasheet.ciiva.com/25798/cl21a106koqnnne-25798133.pdf; ComponentLink1Description: https://datasheet.ciiva.com/25798/cl21a106koqnnne-25798133.pdf; ComponentLink2URL: https://datasheet.ciiva.com/16740/cl05b104kq5nnnc-16740697.pdf; ComponentLink2Description: https://datasheet.ciiva.com/16740/cl05b104kq5nnnc-16740697.pdf; ComponentLink3URL: https://datasheet.ciiva.com/15216/getdatasheetpartid-358435-15216234.pdf; ComponentLink3Description: https://datasheet.ciiva.com/15216/getdatasheetpartid-358435-15216234.pdf; Supplier Part Number 1: 1276-1096-1-ND
D4 = 150060RS75000: LED RED CLEAR 0603 SMD 625 nm, 2 V, 30 mA, 250 mcd; Manufacturer: Wurth Electronics; Viewing Angle: 140°; Lens Style: Clear,Rectangular; Luminous Intensity: 250mcd; Forward Current: 30mA; Forward Voltage: 2V; Wavelength: 625nm; Test Current: 20mA; Supplier 1: Digi-Key; Manufacturer Part Number: 150060RS75000; Stock 1: 273101; Pricing 1: 1=0.14, 50=0.129, 100=0.11, 500=0.095 (USD); Mount: Surface Mount; Case/Package: 0603; Color: Red; Case Code (Metric): 1608; Case Code (Imperial): 0603; Min Operating Temperature: -40°C; Max Operating Temperature: 85°C; Package Quantity: 1; Packaging: Cut Tape; Dominant Wavelength: 625nm; Length: 1.6mm; Height: 0.7mm; Width: 0.8mm; REACH SVHC: Unknown; ComponentLink1URL: https://katalog.we-online.de/led/datasheet/150060RS75000.pdf; ComponentLink1Description: https://katalog.we-online.de/led/datasheet/150060RS75000.pdf; ComponentLink2URL: http://www.produktinfo.conrad.com/datenblaetter/750000-774999/759428-da-01-en-CHIPLED_0603_W_KL_ROT_150060RS75000.pdf; ComponentLink2Description: http://www.produktinfo.conrad.com/datenblaetter/750000-774999/759428-da-01-en-CHIPLED_0603_W_KL_ROT_150060RS75000.pdf; Supplier Part Number 1: 732-4978-1-ND
D18 D19 = 150060VS75000: LED GREEN CLEAR 0603 SMD  LED, 0603, B GREEN,  40MCD, 570NM; Manufacturer: Wurth Electronics; Viewing Angle: 140°; Forward Voltage: 2V; Lens Style: Clear,Rectangular; Forward Current: 30mA; Test Current: 20mA; Supplier 1: Digi-Key; Manufacturer Part Number: 150060VS75000; Stock 1: 207370; Pricing 1: 1=0.14, 50=0.129, 100=0.11, 500=0.095 (USD); Mount: Surface Mount; Case/Package: 0603; Number of Pins: 2; Color: Green; Case Code (Metric): 1608; Case Code (Imperial): 0603; Min Operating Temperature: -40°C; Max Operating Temperature: 85°C; Luminous Intensity: 40mcd; Wavelength: 570nm; Package Quantity: 1; Packaging: Tape and Reel; Dominant Wavelength: 570nm; Length: 1.6mm; Height: 0.7mm; Width: 0.8mm; REACH SVHC: Unknown; ComponentLink1URL: http://www.farnell.com/datasheets/1911347.pdf; ComponentLink1Description: http://www.farnell.com/datasheets/1911347.pdf; ComponentLink2URL: https://katalog.we-online.de/led/datasheet/150060VS75000.pdf; ComponentLink2Description: https://katalog.we-online.de/led/datasheet/150060VS75000.pdf; ComponentLink3URL: https://www.distrelec.biz/Web/Downloads/_t/ds/150060VS75000_eng_tds.pdf?mime=application%2Fpdf; ComponentLink3Description: https://www.distrelec.biz/Web/Downloads/_t/ds/150060VS75000_eng_tds.pdf?mime=application%2Fpdf; ComponentLink4URL: http://www.produktinfo.conrad.com/datenblaetter/750000-774999/759431-da-01-en-CHIPLED_0603_W_KL_H_GRUEN_150060VS7500.pdf; ComponentLink4Description: http://www.produktinfo.conrad.com/datenblaetter/750000-774999/759431-da-01-en-CHIPLED_0603_W_KL_H_GRUEN_150060VS7500.pdf; Supplier Part Number 1: 732-4980-1-ND
FB1 FB2 = FBMJ4516HL230NTV: FERRITE BEAD Ind Chip Bead Multi-Layer 23Ohm 30% 100MHz Ferrite 3.5A 1806 T/R; Manufacturer: Taiyo Yuden; Resistance: 180623R; Number of Lines: 1; DC Resistance (DCR): 14mR; Supplier 1: Digi-Key; Manufacturer Part Number: FBMJ4516HL230NTV; Stock 1: 1819; Pricing 1: 1=0.26, 10=0.202, 25=0.1676, 50=0.1444, 100=0.1299, 250=0.1097, 500=0.0982, 1000=0.0837 (USD); Mount: Surface Mount; Case/Package: 1806; Core Material: Ferrite; Case Code (Metric): 4516; Case Code (Imperial): 1806; Min Operating Temperature: -40°C; Max Operating Temperature: 125°C; Tolerance: 30%; Impedance: 23R; Package Quantity: 2000; Packaging: Tape and Reel; Max DC Current: 3.5A; Termination: SMD/SMT; Test Frequency: 100MHz; Length: 0.177inch; Height: 1.1mm; Width: 1.6mm; Depth: 1.6mm; ComponentLink1URL: http://www.mouser.com/ds/2/396/chipbeads01_e-559265.pdf; ComponentLink1Description: http://www.mouser.com/ds/2/396/chipbeads01_e-559265.pdf; ComponentLink2URL: http://ds.yuden.co.jp/TYCOMPAS/ut/detail.do?productNo=FBMJ4516HL230NTV&fileName=FBMJ4516HL230NTV_SS&mode=specSheetDownload; ComponentLink2Description: http://ds.yuden.co.jp/TYCOMPAS/ut/detail.do?productNo=FBMJ4516HL230NTV&fileName=FBMJ4516HL230NTV_SS&mode=specSheetDownload; ComponentLink3URL: https://www.yuden.co.jp/ut/product/category/emisuppression/FBMJ4516HL230NTV_SS.pdf; ComponentLink3Description: https://www.yuden.co.jp/ut/product/category/emisuppression/FBMJ4516HL230NTV_SS.pdf; Supplier Part Number 1: 587-3857-1-ND
JP4 = M20-9990246: CONN_HeaderPins2pos Headers & Wire Housings 02 SIL VERTICAL PIN HEADER TIN; Manufacturer: Harwin; Contact Resistance: 30mR; Max Current Rating: 3A; Number of Positions: 2; Gender: Male; Connector Type: Male Pin; Insulation Resistance: 10GR; Voltage Rating (AC): 750V; Pitch: 2.54mm; Supplier 1: Digi-Key; Manufacturer Part Number: M20-9990246; Stock 1: 53577; Pricing 1: 1=0.11, 10=0.099, 100=0.0609, 500=0.0504, 1000=0.0441, 5000=0.0378, 10000=0.0368 (USD); Case/Package: SIL; Colour: Black; Housing Colour: Black; Housing Material: Nylon; Contact Plating: Tin; Contact Material: Bronze,Brass; Min Operating Temperature: -40°C; Max Operating Temperature: 105°C; Package Quantity: 1000; Packaging: Bulk; Termination: Solder; Number of Rows: 1; Number of Contacts: 2; Orientation: Straight; Current Rating: 3A; Length: 5.08mm; Depth: 2.54mm; Contact Mating Length: 0.24inch; Radiation Hardening: No; REACH SVHC: No SVHC; ComponentLink1URL: https://datasheet.ciiva.com/8046/315376-8046930.pdf; ComponentLink1Description: https://datasheet.ciiva.com/8046/315376-8046930.pdf; ComponentLink2URL: https://datasheet.ciiva.com/6833/m20-999-6833368.pdf; ComponentLink2Description: https://datasheet.ciiva.com/6833/m20-999-6833368.pdf; ComponentLink3URL: https://datasheet.ciiva.com/11745/0900766b81034e61-11745755.pdf; ComponentLink3Description: https://datasheet.ciiva.com/11745/0900766b81034e61-11745755.pdf; ComponentLink4URL: https://datasheet.ciiva.com/22660/1830818-22660571.pdf; ComponentLink4Description: https://datasheet.ciiva.com/22660/1830818-22660571.pdf; ComponentLink5URL: https://datasheet.ciiva.com/26852/getdatasheetpartid-384170-26852203.pdf; ComponentLink5Description: https://datasheet.ciiva.com/26852/getdatasheetpartid-384170-26852203.pdf; Supplier Part Number 1: 952-2262-ND
R8 R51 = RC0402JR-0710KL: RES SMD 10K OHM 5% 1/16W 0402; Manufacturer: Yageo; Resistance: 10kR; Power Rating: 62.5mW; Voltage Rating: 50V; Temperature Coefficient: 100ppm/°C; Max Power Dissipation: 63mW; Supplier 1: Digi-Key; Manufacturer Part Number: RC0402JR-0710KL; Stock 1: 47303622; Pricing 1: 1=0.1, 10=0.018, 100=0.0073, 1000=0.0033, 2500=0.0029, 5000=0.0024 (USD); Case/Package: 0402; Case Code (Metric): 1005; Case Code (Imperial): 0402; Min Operating Temperature: -55°C; Max Operating Temperature: 155°C; Packaging: Tape and Reel; Tolerance: 5%; Package Quantity: 1; Composition: Thick Film; Number of Terminations: 2; Termination: SMD/SMT; Military Standard: Not; Features: Moisture Resistant; Length: 1mm; Height: 0.016inch; Width: 0.02inch; Depth: 0.5mm; REACH SVHC: Unknown; Lead Free: Lead Free; Supplier Part Number 1: 311-10KJRCT-ND
R15-R17 R23 = RC0402JR-072K2L: as R6 on sheet VCU_Schematic; Supplier 1: Digi-Key; Manufacturer Part Number: RC0402JR-072K2L; Stock 1: 7890813; Pricing 1: 1=0.1, 10=0.018, 100=0.0073, 1000=0.0033, 2500=0.0029, 5000=0.0024 (USD); Case/Package: 0402; Weight: 2.3E-05oz; Case Code (Metric): 1005; Case Code (Imperial): 0402; Min Operating Temperature: -55°C; Max Operating Temperature: 155°C; Tolerance: 5%; Packaging: Tape and Reel; Composition: Thick Film; Termination: SMD/SMT; Military Standard: Not; Package Quantity: 1; Number of Terminations: 2; Max Power Dissipation: 63mW; Working Voltage: 50V; Features: Moisture Resistant; Length: 1mm; Height: 0.016inch; Depth: 0.5mm; Width: 0.02inch; REACH SVHC: Unknown; Lead Free: Lead Free; Supplier Part Number 1: 311-2.2KJRCT-ND
R20 R47 = RC0402JR-070RL: RES SMD 0 OHM 1/16W 0402; Manufacturer: Yageo; Resistance: 0mR; Power Rating: 62.5mW; Tolerance: 5%; Voltage Rating: 50V; Max Power Dissipation: 63mW; Temperature Coefficient: 200ppm/°C; Supplier 1: Digi-Key; Manufacturer Part Number: RC0402JR-070RL; Stock 1: 44333412; Pricing 1: 1=0.1, 10=0.017, 25=0.0124, 50=0.0096, 100=0.007, 250=0.0054, 500=0.0043, 1000=0.0032, 5000=0.0023 (USD); Case/Package: 0402; Contact Plating: Matte,Tin; Case Code (Metric): 1005; Case Code (Imperial): 0402; Min Operating Temperature: -55°C; Max Operating Temperature: 155°C; Packaging: Tape and Reel; Composition: Thick Film; Package Quantity: 1; Number of Terminations: 2; Termination: SMD/SMT; Military Standard: Not; Features: Moisture Resistant; Length: 1mm; Height: 0.016inch; Width: 0.02inch; Depth: 0.5mm; Radiation Hardening: No; REACH SVHC: Unknown; Lead Free: Lead Free; Supplier Part Number 1: 311-0.0JRCT-ND
R45 R46 = RC0402FR-07280RL: RES SMD 280 OHM 1% 1/16W 0402; Manufacturer: Yageo; Power Rating: 62.5mW; Voltage Rating: 50V; Temperature Coefficient: 100ppm/°C; Max Power Dissipation: 63mW; Supplier 1: Digi-Key; Manufacturer Part Number: RC0402FR-07280RL; Stock 1: 282493; Pricing 1: 1=0.1, 10=0.016, 100=0.0067, 1000=0.003, 2500=0.0026, 5000=0.0022 (USD); Case/Package: 0402; Weight: 2.3E-05oz; Case Code (Imperial): 0402; Case Code (Metric): 1005; Min Operating Temperature: -55°C; Max Operating Temperature: 155°C; Resistance: 280R; Tolerance: 1%; Packaging: Tape and Reel; Package Quantity: 1; Termination: SMD/SMT; Composition: Thick Film; Number of Terminations: 2; Military Standard: Not; Voltage Rating (DC): 50V; Features: Moisture Resistant; Length: 1mm; Height: 0.016inch; Width: 0.5mm; Depth: 0.5mm; Lead Free: Lead Free; ComponentLink1URL: http://www.yageo.com.tw/exep/pages/download/literatures/PYu-R_INT-thick_7.pdf; ComponentLink1Description: http://www.yageo.com.tw/exep/pages/download/literatures/PYu-R_INT-thick_7.pdf; ComponentLink2URL: http://www.yageo.com/documents/recent/PYu-RC_Group_51_RoHS_L_9.pdf; ComponentLink2Description: http://www.yageo.com/documents/recent/PYu-RC_Group_51_RoHS_L_9.pdf; ComponentLink3URL: http://www.yageo.com/documents/recent/PYu-RC0402_51_RoHS_L_6_r.pdf; ComponentLink3Description: http://www.yageo.com/documents/recent/PYu-RC0402_51_RoHS_L_6_r.pdf; Supplier Part Number 1: 311-280LRCT-ND
S1 S2 = PTS645SM43SMTR92LFS: SWITCH TACTILE SPST-NO 0.05A 12V; Manufacturer: ITT C&K; Mechanical Life: 100000Cycles; Actuator Material: Nylon,Polyamide; Throw Configuration: SPST; Contact Resistance: 100mR; Operating Force: 160gf; Max Current Rating: 50mA; Illumination Type: Non-Illuminated,Illuminated; Switch Function: Off-Mom; Actuator Length: 0.85mm; Supplier 1: Digi-Key; Manufacturer Part Number: PTS645SM43SMTR92LFS; Stock 1: 188827; Pricing 1: 1=0.16, 10=0.157, 25=0.1516, 50=0.1462, 100=0.1381, 250=0.13, 500=0.1245 (USD); Mount: Surface Mount; Case/Package: SMD/SMT; Contact Plating: Silver; Contact Material: Silver; Colour: Black; Min Operating Temperature: -20°C; Max Operating Temperature: 60°C; Max Voltage Rating (DC): 12V; Packaging: Tape and Reel; Package Quantity: 1000; Current Rating: 50mA; Voltage Rating (DC): 12V; Termination: Gull Wing; Orientation: Straight; Length: 6mm; Depth: 9mm; REACH SVHC: No SVHC; Lead Free: Lead Free; ComponentLink1URL: https://datasheet.ciiva.com/29903/getdatasheetpartid-786341-29903846.pdf; ComponentLink1Description: https://datasheet.ciiva.com/29903/getdatasheetpartid-786341-29903846.pdf; ComponentLink2URL: https://datasheet.ciiva.com/14920/pts645-14920733.pdf; ComponentLink2Description: https://datasheet.ciiva.com/14920/pts645-14920733.pdf; ComponentLink3URL: https://datasheet.ciiva.com/14920/pts645-14920734.pdf; ComponentLink3Description: https://datasheet.ciiva.com/14920/pts645-14920734.pdf; ComponentLink4URL: https://datasheet.ciiva.com/14920/pts645-14920735.pdf; ComponentLink4Description: https://datasheet.ciiva.com/14920/pts645-14920735.pdf; ComponentLink5URL: https://datasheet.ciiva.com/29931/getdatasheetpartid-764615-29931183.pdf; ComponentLink5Description: https://datasheet.ciiva.com/29931/getdatasheetpartid-764615-29931183.pdf; Supplier Part Number 1: CKN9112CT-ND
U5 = TMS5701227CPGEQQ1: as U5 on sheet Power_MCU; Supplier 1: Digi-Key; Manufacturer Part Number: TMS5701227CPGEQQ1; Stock 1: 2872; Pricing 1: 1=24.99, 10=23.046, 60=22.0098, 120=19.6794, 540=17.8669 (USD); Case/Package: LQFP; Number of Pins: 144; Min Operating Temperature: -40°C; Max Operating Temperature: 125°C; Packaging: Tray; Number of Programmable I/O: 58; Max Frequency: 160MHz; Memory Type: FLASH; Number of GPIO: 58; Core Architecture: ARM; Lead Free: Lead Free; Supplier Part Number 1: 296-42451-ND
U9 = FT230XQ-R: IC USB SERIAL BASIC UART 16QFN; Manufacturer: FTDI; Operating Supply Voltage: 5V; Data Rate: 12Mbps; Number of Channels: 1; Max Supply Voltage: 5.5V; Min Supply Voltage: 2.97V; Interface: USB,UART; Operating Supply Current: 8mA; Supplier 1: Digi-Key; Manufacturer Part Number: FT230XQ-R; Stock 1: 185744; Pricing 1: 1=2.04, 25=1.97, 100=1.9, 250=1.71, 500=1.54, 1000=1.4806 (USD); Mount: Surface Mount; Case/Package: QFN; Number of Pins: 16; Weight: 0.002014oz; Min Operating Temperature: -40°C; Max Operating Temperature: 85°C; Packaging: Tape and Reel; Package Quantity: 5000; Length: 4mm; Height: 0.75mm; Width: 4mm; Lead Free: Lead Free; ComponentLink1URL: https://datasheet.ciiva.com/16213/ds-ft230x-16213755.pdf; ComponentLink1Description: https://datasheet.ciiva.com/16213/ds-ft230x-16213755.pdf; ComponentLink2URL: https://datasheet.ciiva.com/48909/70403914-48909084.pdf; ComponentLink2Description: https://datasheet.ciiva.com/48909/70403914-48909084.pdf; ComponentLink3URL: https://datasheet.ciiva.com/1787/ft-x-series-1787309.pdf; ComponentLink3Description: https://datasheet.ciiva.com/1787/ft-x-series-1787309.pdf; ComponentLink4URL: https://datasheet.ciiva.com/1787/ft-x-series-1787310.pdf; ComponentLink4Description: https://datasheet.ciiva.com/1787/ft-x-series-1787310.pdf; ComponentLink5URL: https://datasheet.ciiva.com/1787/ft-x-series-1787311.pdf; ComponentLink5Description: https://datasheet.ciiva.com/1787/ft-x-series-1787311.pdf; ComponentLink6URL: https://datasheet.ciiva.com/30478/0900766b811020cb-30478159.pdf; ComponentLink6Description: https://datasheet.ciiva.com/30478/0900766b811020cb-30478159.pdf; Supplier Part Number 1: 768-1130-1-ND
U10 = STWD100YNYWY3F: IC WATCHDOG TIME CIRCUIT SOT23-5; Manufacturer: STMicroelectronics; Number of Voltages Monitored: 1; Reset: Active Low; Reset Timeout: 1.12s; Max Supply Voltage: 5.5V; Operating Supply Current: 13uA; Max Power Dissipation: 320mW; Min Supply Voltage: 2.7V; Supplier 1: Digi-Key; Manufacturer Part Number: STWD100YNYWY3F; Stock 1: 37; Pricing 1: 1=0.94, 10=0.842, 100=0.6562, 500=0.5421, 1000=0.428 (USD); Mount: Surface Mount; Case/Package: SOT-23-5; Number of Pins: 5; Contact Plating: Gold; Min Operating Temperature: -40°C; Max Operating Temperature: 125°C; Package Quantity: 1; Packaging: Tape and Reel; Number of Monitored Inputs: 1; Type: Watchdog Circuit; Radiation Hardening: No; Lead Free: Lead Free; ComponentLink1URL: http://www.st.com/st-web-ui/static/active/en/resource/technical/document/datasheet/CD00176077.pdf?src-supplier=Avnet; ComponentLink1Description: http://www.st.com/st-web-ui/static/active/en/resource/technical/document/datasheet/CD00176077.pdf?src-supplier=Avnet; ComponentLink2URL: http://www.st.com/content/ccc/resource/sales_and_marketing/promotional_material/flyer/52/2d/7f/6c/74/bb/43/70/flcarefree1213.pdf/files/flcarefree1213.pdf/jcr:content/translations/en.flcarefree1213.pdf?src-supplier=Digi-Key; ComponentLink2Description: http://www.st.com/content/ccc/resource/sales_and_marketing/promotional_material/flyer/52/2d/7f/6c/74/bb/43/70/flcarefree1213.pdf/files/flcarefree1213.pdf/jcr:content/translations/en.flcarefree1213.pdf?src-supplier=Digi-Key; ComponentLink3URL: http://www.st.com/content/ccc/resource/technical/document/datasheet/06/6a/b3/83/9a/c7/4f/22/CD00176077.pdf/files/CD00176077.pdf/jcr:content/translations/en.CD00176077.pdf?src-supplier=Digi-Key; ComponentLink3Description: http://www.st.com/content/ccc/resource/technical/document/datasheet/06/6a/b3/83/9a/c7/4f/22/CD00176077.pdf/files/CD00176077.pdf/jcr:content/translations/en.CD00176077.pdf?src-supplier=Digi-Key; Supplier Part Number 1: 497-14411-1-ND
X6 = FTSH-105-01-F-DV-K: CONN_JTAG_10pin .050 Connector Dual Header 10 Position Surface Mount; Manufacturer: Samtec; Max Current Rating: 1.75A; Number of Positions: 10; Connector Type: Male Pin; Pitch: 1.27mm; Row Spacing: 0.05inch; Supplier 1: Digi-Key; Manufacturer Part Number: FTSH-105-01-F-DV-K; Stock 1: 18199; Pricing 1: 1=2.9, 10=2.784, 100=2.32, 500=1.972, 1000=1.682, 5000=1.508 (USD); Mount: Surface Mount; Contact Material: Bronze,Copper; Contact Plating: Nickel,Gold; Colour: Black; Housing Colour: Black; Housing Material: Polymer; Min Operating Temperature: -55°C; Max Operating Temperature: 125°C; Number of Rows: 2; Packaging: Rail/Tube; Package Quantity: 1; Termination: Solder; Number of Contacts: 10; Orientation: Straight; Length: 15.2mm; Height: 3.3mm; Contact Mating Length: 0.12inch; Depth: 3.43mm; Radiation Hardening: No; Lead Free: Lead Free; ComponentLink1URL: https://datasheet.ciiva.com/19461/2046846-19461026.pdf; ComponentLink1Description: https://datasheet.ciiva.com/19461/2046846-19461026.pdf; ComponentLink2URL: https://datasheet.ciiva.com/738/ftsh-1xx-xx-xxx-dv-xxx-mkt-738998.pdf; ComponentLink2Description: https://datasheet.ciiva.com/738/ftsh-1xx-xx-xxx-dv-xxx-mkt-738998.pdf; ComponentLink3URL: https://datasheet.ciiva.com/10245/ftsh-mt-10245273.pdf; ComponentLink3Description: https://datasheet.ciiva.com/10245/ftsh-mt-10245273.pdf; ComponentLink4URL: https://datasheet.ciiva.com/16657/ftsh-mt-16657371.pdf; ComponentLink4Description: https://datasheet.ciiva.com/16657/ftsh-mt-16657371.pdf; ComponentLink5URL: https://datasheet.ciiva.com/15195/getdatasheetpartid-133463-15195260.pdf; ComponentLink5Description: https://datasheet.ciiva.com/15195/getdatasheetpartid-133463-15195260.pdf; Supplier Part Number 1: SAM8796-ND
X7 = 10118192-0001LF: CONN_USB - micro B USB 2.0 Receptacle Connector 5 Position Surface Mount, Right Angle, Horizontal; Manufacturer: Amphenol FCI; Current Rating: 1.8A; Connector Type: USB,Receptacle; Number of Contacts: 5; Insulation Resistance: 1GR; Number of Ports: 1; Max Voltage Rating (AC): 100V; USB Standard: USB 2.0; Pitch: 0.65mm; Supplier 1: Digi-Key; Manufacturer Part Number: 10118192-0001LF; Stock 1: 197826; Pricing 1: 1=0.46, 10=0.437, 25=0.3744, 50=0.318, 100=0.3056, 250=0.2744, 500=0.262 (USD); Mount: Surface Mount,Horizontal; Contact Material: Copper Alloy; Contact Plating: Nickel,Gold; Number of Terminals: 5; Housing Material: Polymer; Colour: Black; Min Operating Temperature: -55°C; Max Operating Temperature: 85°C; Packaging: Tape and Reel; Package Quantity: 1400; Gender: Receptacle; Termination: Solder; Voltage Rating: 100V; Orientation: Right Angle; Length: 7.86mm; Depth: 5.57mm; Radiation Hardening: No; REACH SVHC: No SVHC; Lead Free: Lead Free; Flammability Rating: UL94 V-0; ComponentLink1URL: https://datasheet.ciiva.com/26853/getdatasheetpartid-418041-26853891.pdf; ComponentLink1Description: https://datasheet.ciiva.com/26853/getdatasheetpartid-418041-26853891.pdf; ComponentLink2URL: https://datasheet.ciiva.com/851/10118192-851112.pdf; ComponentLink2Description: https://datasheet.ciiva.com/851/10118192-851112.pdf; ComponentLink3URL: https://datasheet.ciiva.com/4598/10118192ac-197249-4598796.pdf; ComponentLink3Description: https://datasheet.ciiva.com/4598/10118192ac-197249-4598796.pdf; Supplier Part Number 1: 609-4613-1-ND
XTAL1 = ABLS2-16.000MHZ-D4Y-T: XTAL 16MHz ±30ppm Crystal 18pF 40 Ohm -40°C ~ 85°C  Surface Mount HC49/US; Manufacturer: Abracon; ESR (Equivalent Series Resistance): 40R; Supplier 1: Digi-Key; Manufacturer Part Number: ABLS2-16.000MHZ-D4Y-T; Stock 1: 14083; Pricing 1: 1=0.46, 10=0.385, 50=0.3466, 100=0.308, 500=0.2926 (USD); Mount: Surface Mount; Min Operating Temperature: -40°C; Max Operating Temperature: 85°C; Package Quantity: 1000; Frequency: 16MHz; Frequency Tolerance: 30ppm; Load Capacitance: 18pF; Packaging: Tape and Reel; Tolerance: 30ppm; Frequency Stability: 30ppm; Termination: SMD/SMT; Series Resistance: 40R; Length: 11.05mm; Height: 0.13inch; Width: 0.185inch; Depth: 4.8mm; REACH SVHC: Unknown; Lead Free: Lead Free; ComponentLink1URL: https://datasheet.ciiva.com/854/abls2-854400.pdf; ComponentLink1Description: https://datasheet.ciiva.com/854/abls2-854400.pdf; ComponentLink2URL: https://datasheet.ciiva.com/854/abls2-854401.pdf; ComponentLink2Description: https://datasheet.ciiva.com/854/abls2-854401.pdf; ComponentLink3URL: https://datasheet.ciiva.com/15116/getdatasheetpartid-719900-15116780.pdf; ComponentLink3Description: https://datasheet.ciiva.com/15116/getdatasheetpartid-719900-15116780.pdf; ComponentLink4URL: https://datasheet.ciiva.com/854/abls2-854399.pdf; ComponentLink4Description: https://datasheet.ciiva.com/854/abls2-854399.pdf; Supplier Part Number 1: 535-9875-1-ND